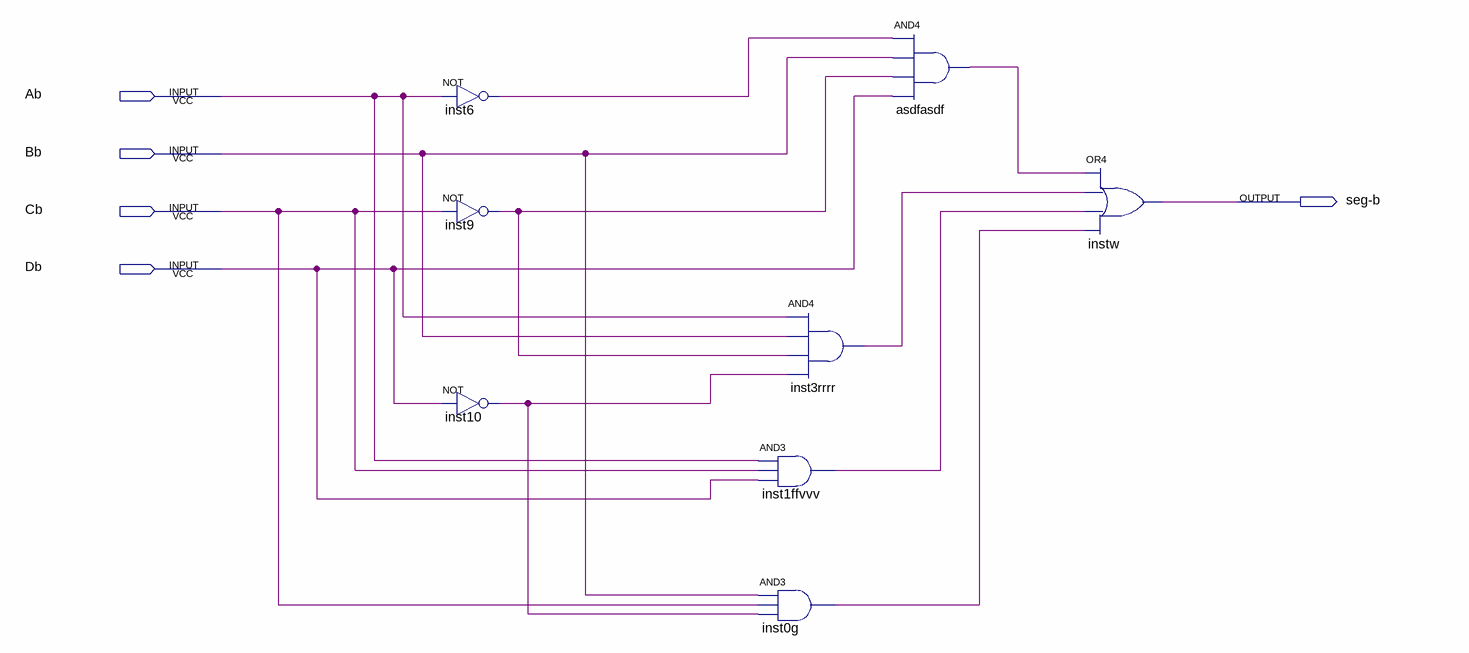
[diagram p0: schematic sheet]
// Quartus schematic segmento_b.bdf as structural Verilog: 8 symbols, 5 pins
module segmento_b (
  input  Ab,
  input  Bb,
  input  Cb,
  input  Db,
  output \seg-b 
);

  wire asdfasdf_out, inst0g_out, inst1ffvvv_out, inst3rrrr_out, inst6_out, inst9_out, inst10_out;

  not inst6 (inst6_out, Ab);
  not inst9 (inst9_out, Cb);
  not inst10 (inst10_out, Db);
  and inst1ffvvv (inst1ffvvv_out, Ab, Cb, Db);
  and inst0g (inst0g_out, Bb, Cb, inst10_out);
  and inst3rrrr (inst3rrrr_out, Ab, Bb, inst9_out, inst10_out);
  and asdfasdf (asdfasdf_out, inst6_out, Bb, inst9_out, Db);
  or instw (\seg-b , asdfasdf_out, inst3rrrr_out, inst1ffvvv_out, inst0g_out);
endmodule
